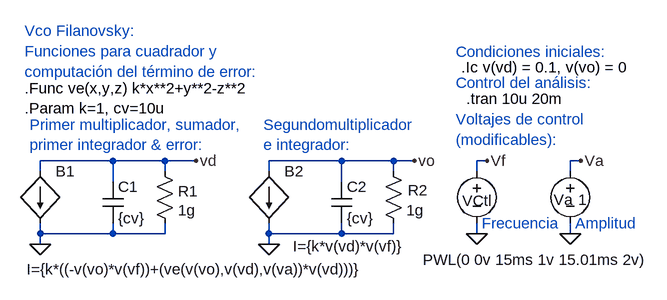
[diagram p0: schematic FilanovskyVco.asc]
FilanovskyVco.asc, the LTspice schematic file:
Version 4
SHEET 1 896 836
WIRE -832 416 -832 400
WIRE -832 512 -832 496
WIRE -832 528 -832 512
WIRE -720 400 -832 400
WIRE -720 432 -720 400
WIRE -720 512 -832 512
WIRE -720 512 -720 496
WIRE -640 400 -720 400
WIRE -640 416 -640 400
WIRE -640 512 -720 512
WIRE -640 512 -640 496
WIRE -592 400 -640 400
WIRE -480 416 -480 400
WIRE -480 512 -480 496
WIRE -480 528 -480 512
WIRE -368 400 -480 400
WIRE -368 432 -368 400
WIRE -368 512 -480 512
WIRE -368 512 -368 496
WIRE -288 400 -368 400
WIRE -288 416 -288 400
WIRE -288 512 -368 512
WIRE -288 512 -288 496
WIRE -256 400 -288 400
WIRE -160 416 -160 400
WIRE -160 512 -160 496
WIRE -144 400 -160 400
WIRE -16 416 -16 400
WIRE -16 512 -16 496
WIRE 0 400 -16 400
FLAG -832 528 0
FLAG -592 400 vd
FLAG -480 528 0
FLAG -256 400 vo
FLAG -16 512 0
FLAG 0 400 Va
FLAG -160 512 0
FLAG -144 400 Vf
SYMBOL bi -832 416 R0
WINDOW 3 -21 151 Left 0
SYMATTR Value I={k*((-v(vo)*v(vf))+(ve(v(vo),v(vd),v(va))*v(vd)))}
SYMATTR InstName B1
SYMBOL cap -736 432 R0
SYMATTR InstName C1
SYMATTR Value {cv}
SYMBOL res -656 400 R0
WINDOW 0 36 47 Left 0
SYMATTR InstName R1
SYMATTR Value 1g
SYMBOL bi -480 416 R0
WINDOW 3 37 115 Left 0
SYMATTR Value I={k*v(vd)*v(vf)}
SYMATTR InstName B2
SYMBOL cap -384 432 R0
SYMATTR InstName C2
SYMATTR Value {cv}
SYMBOL res -304 400 R0
WINDOW 0 38 45 Left 0
SYMATTR InstName R2
SYMATTR Value 1g
SYMBOL voltage -16 400 R0
WINDOW 0 -25 60 Left 0
WINDOW 3 12 60 Left 0
SYMATTR InstName Va
SYMATTR Value 1
SYMBOL voltage -160 400 R0
WINDOW 0 -22 61 Left 0
WINDOW 3 -83 152 Left 0
WINDOW 123 0 0 Left 0
WINDOW 39 0 0 Left 0
SYMATTR InstName VCtl
SYMATTR Value PWL(0 0v 15ms 1v 15.01ms 2v)
TEXT -856 288 Left 0 !.Func ve(x,y,z) k*x**2+y**2-z**2\n.Param k=1, cv=10u
TEXT -848 344 Left 0 ;Primer multiplicador, sumador,\nprimer integrador & error:
TEXT -488 344 Left 0 ;Segundomultiplicador\ne integrador:
TEXT -192 232 Left 0 ;Condiciones iniciales:
TEXT -184 256 Left 0 !.Ic v(vd) = 0.1, v(vo) = 0
TEXT -192 336 Left 0 ;Voltajes de control\n(modificables):
TEXT -192 280 Left 0 ;Control del análisis:
TEXT -176 304 Left 0 !.tran 10u 20m
TEXT -856 200 Left 0 ;Vco Filanovsky:\nFunciones para cuadrador y\ncomputación del término de error:
TEXT -8 496 Left 0 ;Amplitud
TEXT -152 496 Left 0 ;Frecuencia

The netlist it stands for:
* FilanovskyVco.asc
B1 vd 0 I={k*((-v(vo)*v(vf))+(ve(v(vo),v(vd),v(va))*v(vd)))}
C1 vd 0 {cv}
R1 vd 0 1g
B2 vo 0 I={k*v(vd)*v(vf)}
C2 vo 0 {cv}
R2 vo 0 1g
Va Va 0 1
VCtl Vf 0 PWL(0 0v 15ms 1v 15.01ms 2v)
.Func ve(x,y,z) k*x**2+y**2-z**2
.Param k=1, cv=10u
* Primer multiplicador, sumador,
* primer integrador & error:
* Segundomultiplicador
* e integrador:
* Condiciones iniciales:
.Ic v(vd) = 0.1, v(vo) = 0
* Voltajes de control
* (modificables):
* Control del análisis:
.tran 10u 20m
* Vco Filanovsky:
* Funciones para cuadrador y
* computación del término de error:
* Amplitud
* Frecuencia
.backanno
.end